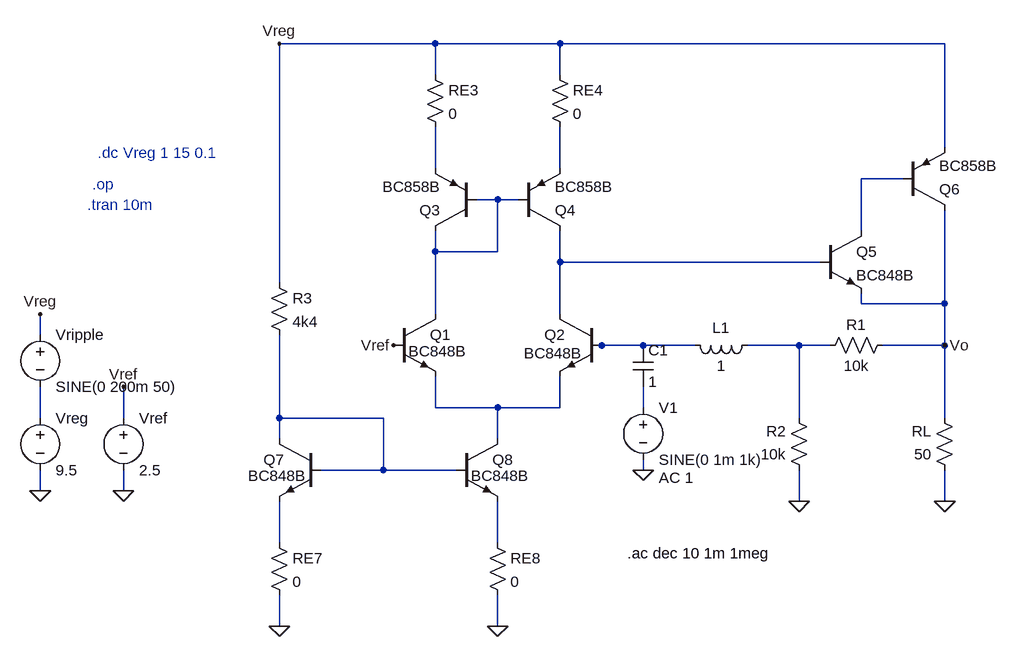
[diagram p0: schematic draft-circuitos.asc]
draft-circuitos.asc, the LTspice schematic file:
Version 4.1
SHEET 1 880 680
WIRE -96 -416 -336 -416
WIRE 96 -416 -96 -416
WIRE 688 -416 96 -416
WIRE -96 -368 -96 -416
WIRE 96 -368 96 -416
WIRE 688 -256 688 -416
WIRE -96 -224 -96 -288
WIRE 96 -224 96 -288
WIRE 624 -208 560 -208
WIRE 0 -176 -32 -176
WIRE 32 -176 0 -176
WIRE 560 -128 560 -208
WIRE -96 -96 -96 -128
WIRE 0 -96 0 -176
WIRE 0 -96 -96 -96
WIRE 96 -80 96 -128
WIRE 496 -80 96 -80
WIRE -336 -48 -336 -416
WIRE 560 -16 560 -32
WIRE 688 -16 688 -160
WIRE 688 -16 560 -16
WIRE -96 0 -96 -96
WIRE 96 0 96 -80
WIRE -704 32 -704 0
WIRE 160 48 144 48
WIRE 224 48 160 48
WIRE 304 48 224 48
WIRE 464 48 384 48
WIRE 512 48 464 48
WIRE 688 48 688 -16
WIRE 688 48 592 48
WIRE -96 144 -96 96
WIRE 0 144 -96 144
WIRE 96 144 96 96
WIRE 96 144 0 144
WIRE 224 144 224 112
WIRE -704 160 -704 112
WIRE -576 160 -576 112
WIRE -336 160 -336 32
WIRE -176 160 -336 160
WIRE 464 160 464 48
WIRE 688 160 688 48
WIRE -336 192 -336 160
WIRE 0 192 0 144
WIRE -176 240 -176 160
WIRE -176 240 -272 240
WIRE -64 240 -176 240
WIRE 224 240 224 224
WIRE -704 272 -704 240
WIRE -576 272 -576 240
WIRE 464 288 464 240
WIRE 688 288 688 240
WIRE -336 352 -336 288
WIRE 0 352 0 288
WIRE -336 480 -336 432
WIRE 0 480 0 432
FLAG 0 480 0
FLAG -336 480 0
FLAG 688 288 0
FLAG 464 288 0
FLAG -576 272 0
FLAG -160 48 Vref
FLAG -576 112 Vref
FLAG -704 272 0
FLAG -704 0 Vreg
FLAG -336 -416 Vreg
FLAG 688 48 Vo
FLAG 224 240 0
SYMBOL pnp 624 -160 M180
SYMATTR InstName Q6
SYMATTR Value BC858B
SYMBOL npn 496 -128 R0
SYMATTR InstName Q5
SYMATTR Value BC848B
SYMBOL npn -160 0 R0
WINDOW 3 23 57 Left 2
SYMATTR InstName Q1
SYMATTR Value BC848B
SYMBOL pnp 32 -128 M180
SYMATTR InstName Q4
SYMATTR Value BC858B
SYMBOL pnp -32 -128 R180
SYMATTR InstName Q3
SYMATTR Value BC858B
SYMBOL npn 160 0 M0
WINDOW 3 30 60 Left 2
SYMATTR InstName Q2
SYMATTR Value BC848B
SYMBOL res -112 -384 R0
SYMATTR InstName RE3
SYMATTR Value 0
SYMBOL res 80 -384 R0
SYMATTR InstName RE4
SYMATTR Value 0
SYMBOL npn -64 192 R0
WINDOW 3 23 57 Left 2
SYMATTR InstName Q8
SYMATTR Value BC848B
SYMBOL npn -272 192 M0
WINDOW 3 23 57 Left 2
SYMATTR InstName Q7
SYMATTR Value BC848B
SYMBOL res -352 336 R0
SYMATTR InstName RE7
SYMATTR Value 0
SYMBOL res -16 336 R0
SYMATTR InstName RE8
SYMATTR Value 0
SYMBOL res 608 32 R90
WINDOW 0 0 56 VBottom 2
WINDOW 3 32 56 VTop 2
SYMATTR InstName R1
SYMATTR Value 10k
SYMBOL res 480 256 R180
WINDOW 0 36 76 Left 2
WINDOW 3 36 40 Left 2
SYMATTR InstName R2
SYMATTR Value 10k
SYMBOL res 704 256 R180
WINDOW 0 36 76 Left 2
WINDOW 3 36 40 Left 2
SYMATTR InstName RL
SYMATTR Value 50
SYMBOL res -352 -64 R0
SYMATTR InstName R3
SYMATTR Value 4k4
SYMBOL voltage -576 144 R0
WINDOW 123 0 0 Left 0
WINDOW 39 0 0 Left 0
SYMATTR InstName Vref
SYMATTR Value 2.5
SYMBOL voltage -704 144 R0
WINDOW 123 0 0 Left 0
WINDOW 39 0 0 Left 0
SYMATTR InstName Vreg
SYMATTR Value 9.5
SYMBOL voltage -704 16 R0
WINDOW 123 0 0 Left 0
WINDOW 39 0 0 Left 0
SYMATTR InstName Vripple
SYMATTR Value SINE(0 200m 50)
SYMBOL cap 208 48 R0
SYMATTR InstName C1
SYMATTR Value 1
SYMBOL voltage 224 128 R0
WINDOW 123 24 124 Left 2
WINDOW 39 0 0 Left 0
SYMATTR InstName V1
SYMATTR Value SINE(0 1m 1k)
SYMATTR Value2 AC 1
SYMBOL ind 400 32 R90
WINDOW 0 5 56 VBottom 2
WINDOW 3 32 56 VTop 2
SYMATTR InstName L1
SYMATTR Value 1
TEXT -624 -200 Left 2 ;.op
TEXT -632 -168 Left 2 ;.tran 10m
TEXT -616 -248 Left 2 ;.dc Vreg 1 15 0.1
TEXT 200 368 Left 2 !.ac dec 10 1m 1meg

The netlist it stands for:
* draft-circuitos.asc
Q6 Vo N003 Vreg 0 BC858B
Q5 N003 N005 Vo 0 BC848B
Q1 N004 Vref N008 0 BC848B
Q4 N005 N004 N002 0 BC858B
Q3 N004 N004 N001 0 BC858B
Q2 N005 N006 N008 0 BC848B
RE3 Vreg N001 0
RE4 Vreg N002 0
Q8 N008 N011 N013 0 BC848B
Q7 N011 N011 N012 0 BC848B
RE7 N012 0 0
RE8 N013 0 0
R1 Vo N007 10k
R2 0 N007 10k
RL 0 Vo 50
R3 Vreg N011 4k4
Vref Vref 0 2.5
Vreg N010 0 9.5
Vripple Vreg N010 SINE(0 200m 50)
C1 N006 N009 1
V1 N009 0 SINE(0 1m 1k) AC 1
L1 N007 N006 1
.model NPN NPN
.model PNP PNP
.lib standard.bjt
* .op
* .tran 10m
* .dc Vreg 1 15 0.1
.ac dec 10 1m 1meg
.backanno
.end